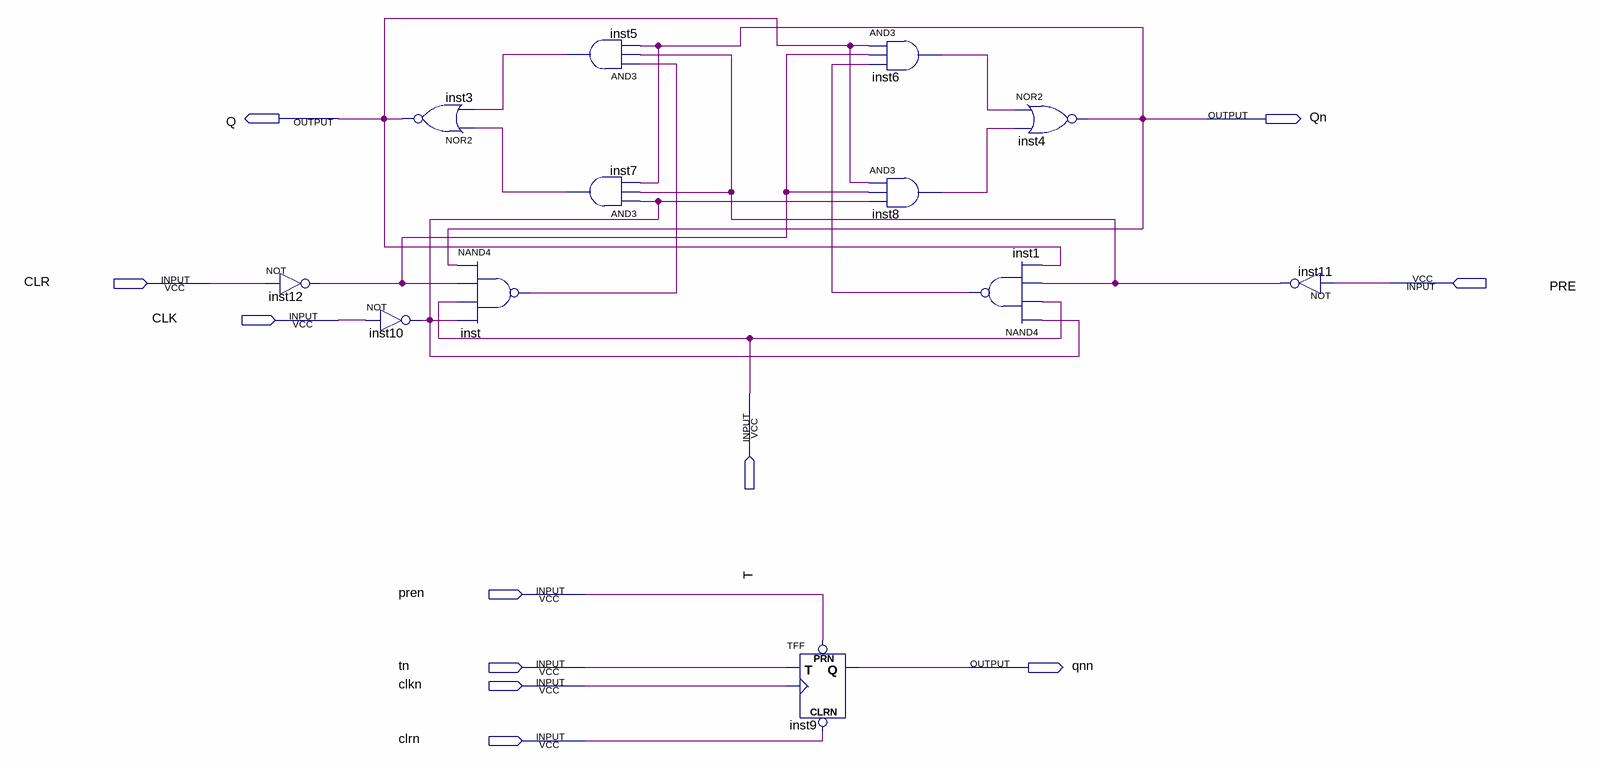
[diagram p0: schematic sheet]
// Quartus schematic FFJK.bdf as structural Verilog: 12 symbols, 11 pins
module FFJK (
  input  CLR,
  input  PRE,
  input  CLK,
  input  T,
  input  pren,
  input  tn,
  input  clkn,
  input  clrn,
  output Q,
  output Qn,
  output qnn
);

  wire inst1_out, inst5_out, inst6_out, inst7_out, inst8_out, inst10_out, inst11_out, inst12_out, inst_out;

  not inst12 (inst12_out, CLR);
  nor inst3 (Q, inst7_out, inst5_out);
  not inst10 (inst10_out, CLK);
  nand inst (inst_out, Qn, inst12_out, T, inst10_out);
  and inst5 (inst5_out, inst_out, inst11_out, Qn);
  and inst7 (inst7_out, inst10_out, inst11_out, Qn);
  TFF inst9 (.PRN(pren), .CLRN(clrn), .T(tn), .CLK(clkn), .Q(qnn));
  and inst6 (inst6_out, Q, inst12_out, inst1_out);
  and inst8 (inst8_out, Q, inst12_out, inst10_out);
  nand inst1 (inst1_out, inst10_out, T, inst11_out, Q);
  nor inst4 (Qn, inst6_out, inst8_out);
  not inst11 (inst11_out, PRE);
endmodule
